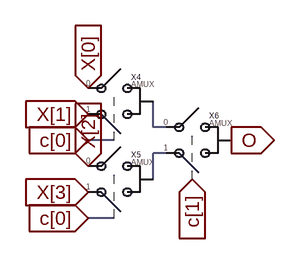
[diagram p0: schematic amux-4to1.asc]
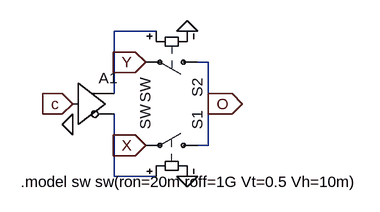
[diagram p1: sub-circuit amux-2to1.asc]
amux-4to1.asc, the LTspice schematic file:
Version 4
SHEET 1 880 680
WIRE -176 -208 -176 -240
WIRE -160 -208 -176 -208
WIRE -224 -192 -256 -192
WIRE -160 -176 -176 -176
WIRE -176 -144 -176 -176
WIRE -224 -96 -256 -96
FLAG -256 -192 c[0]
IOPIN -256 -192 In
FLAG -256 -256 X[0]
IOPIN -256 -256 In
FLAG -256 -224 X[1]
IOPIN -256 -224 In
FLAG -256 -96 c[0]
IOPIN -256 -96 In
FLAG -256 -160 X[2]
IOPIN -256 -160 In
FLAG -256 -128 X[3]
IOPIN -256 -128 In
FLAG -128 -144 c[1]
IOPIN -128 -144 In
FLAG -80 -192 O
IOPIN -80 -192 Out
SYMBOL amux-2to1 -224 -224 R0
SYMATTR InstName X4
SYMBOL amux-2to1 -224 -128 R0
SYMATTR InstName X5
SYMBOL amux-2to1 -128 -176 R0
SYMATTR InstName X6

amux-2to1.asc, the sub-circuit schematic file:
Version 4
SHEET 1 880 680
WIRE 64 -160 0 -160
WIRE 144 -112 128 -112
WIRE 0 -64 0 -160
WIRE 144 -48 144 -112
WIRE 144 16 144 -48
WIRE 144 16 128 16
WIRE 0 64 0 -32
WIRE 64 64 0 64
FLAG 112 64 0
FLAG -64 -48 c
IOPIN -64 -48 In
FLAG 112 -160 0
FLAG 48 16 X
IOPIN 48 16 In
FLAG 48 -112 Y
IOPIN 48 -112 In
FLAG 144 -48 O
IOPIN 144 -48 Out
FLAG -64 -16 0
SYMBOL sw 144 16 M270
SYMATTR InstName S1
SYMBOL sw 144 -112 R90
SYMATTR InstName S2
SYMBOL Digital\\buf -64 -112 R0
SYMATTR InstName A1
TEXT -144 72 Left 0 !.model sw sw(ron=20m roff=1G Vt=0.5 Vh=10m)

The netlist it stands for:
* amux-4to1.asc
XX4 c[0] N001 X[0] X[1] amux-2to1
XX5 c[0] N002 X[2] X[3] amux-2to1
XX6 c[1] O N001 N002 amux-2to1

* block symbol definitions
.subckt amux-2to1 c O X Y
S1 O X N002 0 SW
S2 O Y N001 0 SW
A1 c 0 0 0 0 N002 N001 0 BUF
.model sw sw(ron=20m roff=1G Vt=0.5 Vh=10m)
.ends amux-2to1

.backanno
.end